# Altium schematic sheet 08_FPGA.SchDoc: FPGA
size A3; Organization: Lime Microsystems; Address1: Surrey Tech Centre; Address2: Guildford GU2 7YG; Address3: Surrey; Address4: United Kingdom; Revision: v2.1; SheetNumber: 8; SheetTotal: 15
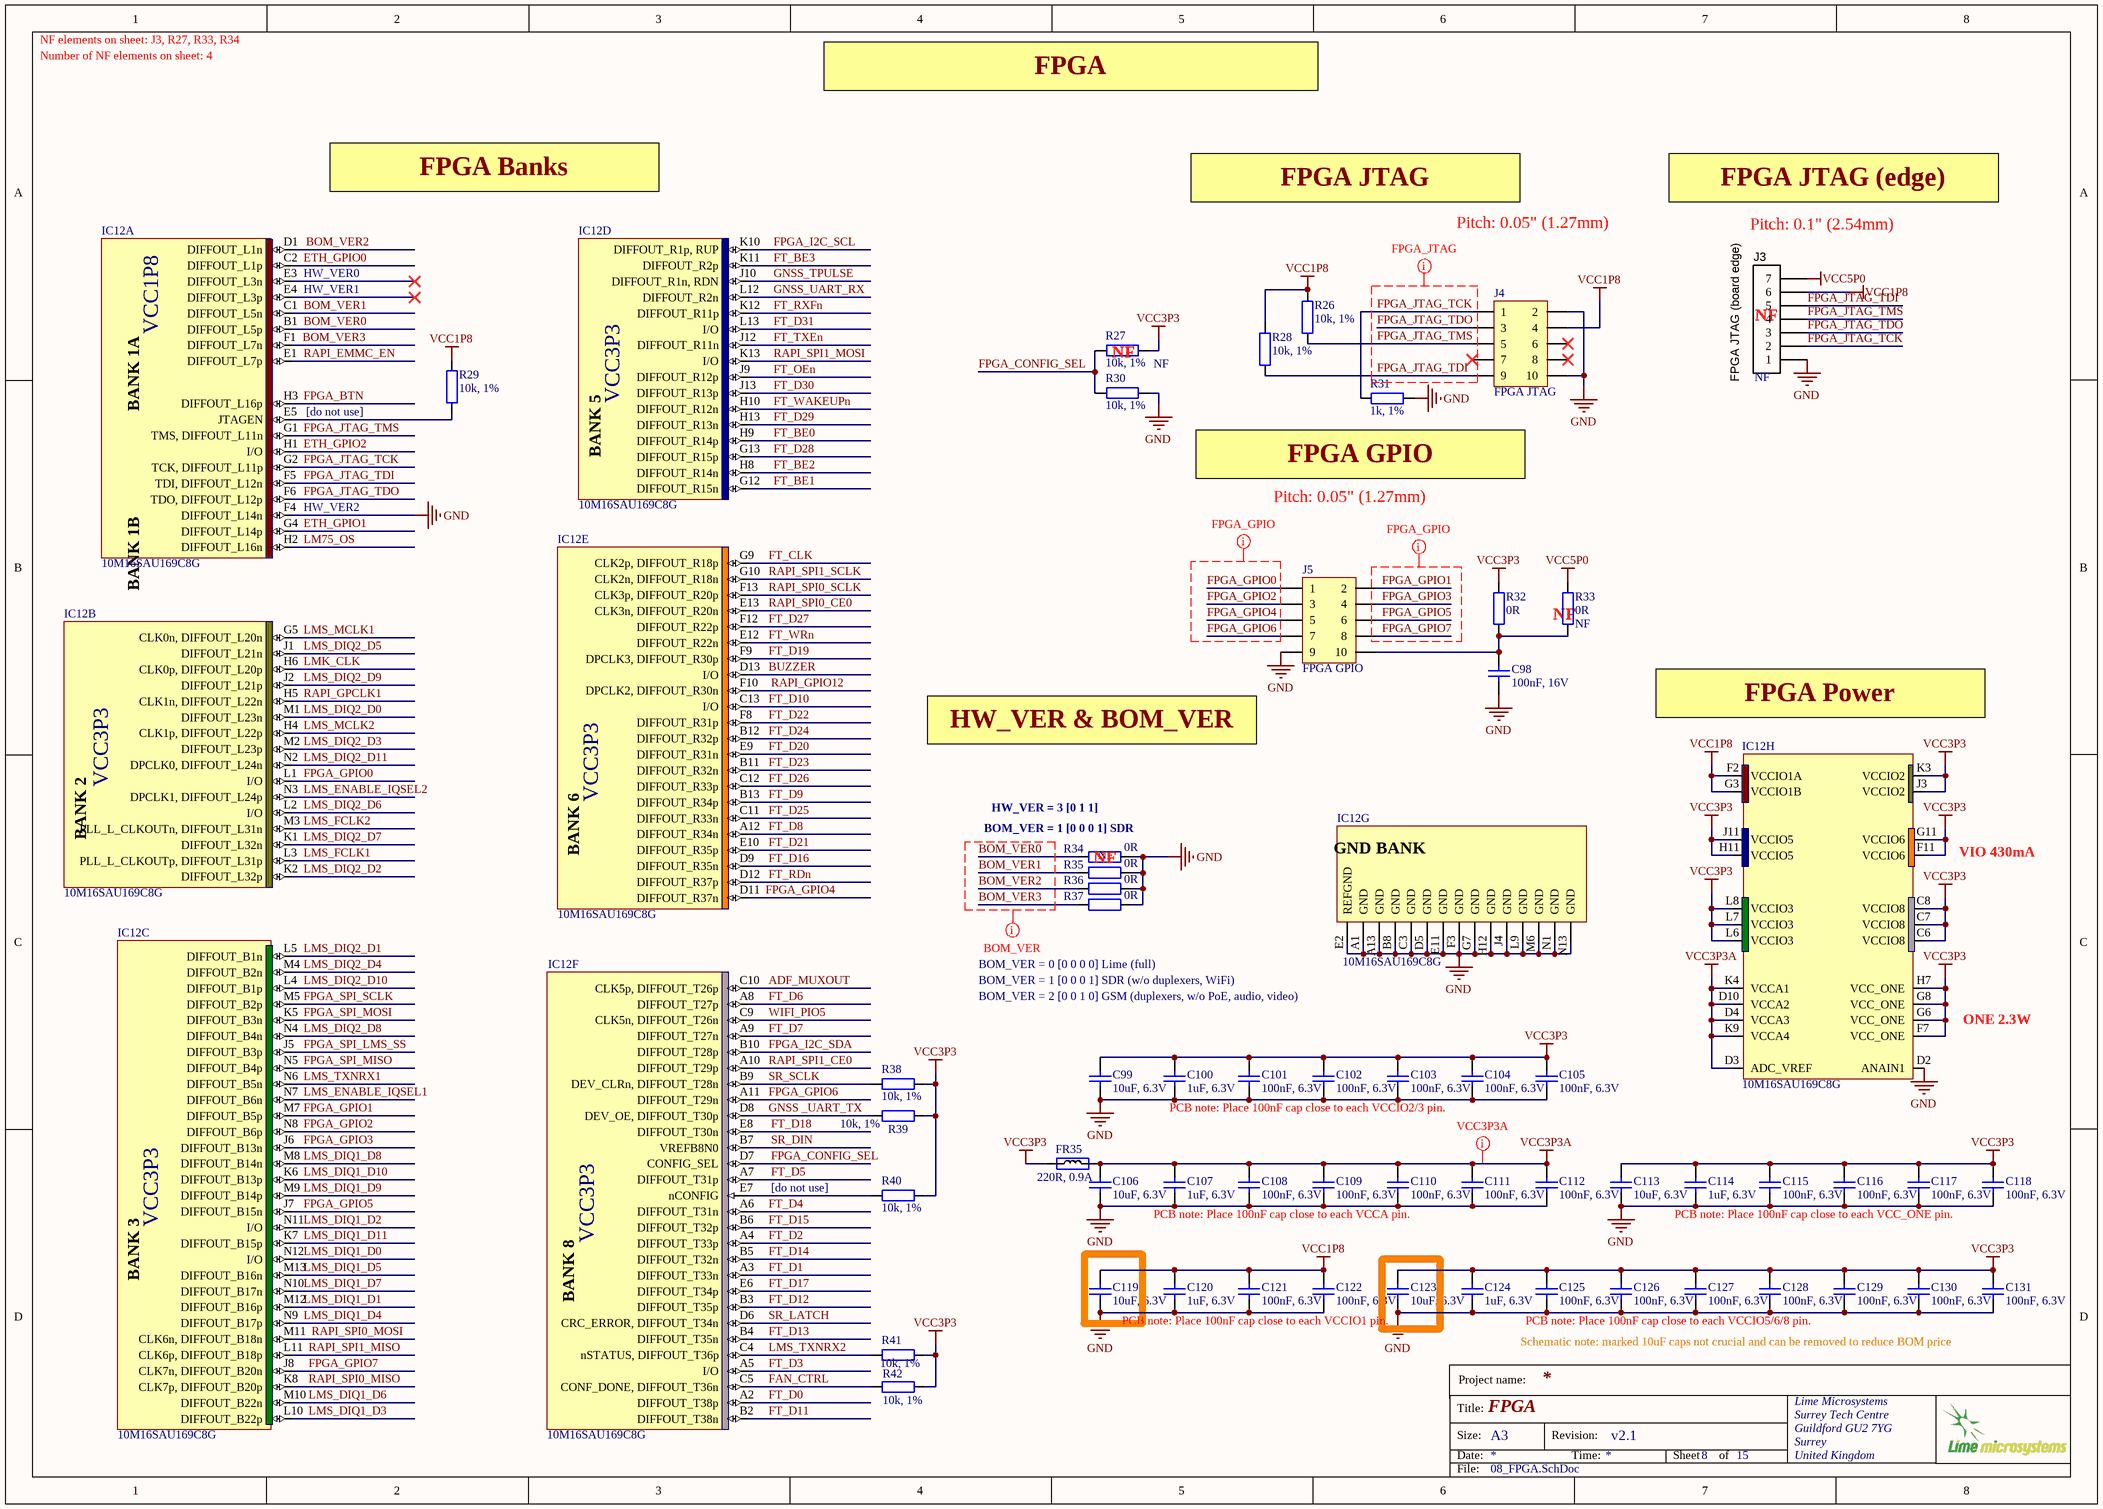
[diagram p0: 08_FPGA.SchDoc]

## Parts
C98  100nF, 16V  [CAP0402]
C99  10uF, 6.3V  [CAP0603]
C100  1uF, 6.3V  [CAP0201]
C101  100nF, 6.3V  [CAP0201]
C102  100nF, 6.3V  [CAP0201]
C103  100nF, 6.3V  [CAP0201]
C104  100nF, 6.3V  [CAP0201]
C105  100nF, 6.3V  [CAP0201]
C106  10uF, 6.3V  [CAP0603]
C107  1uF, 6.3V  [CAP0201]
C108  100nF, 6.3V  [CAP0201]
C109  100nF, 6.3V  [CAP0201]
C110  100nF, 6.3V  [CAP0201]
C111  100nF, 6.3V  [CAP0201]
C112  100nF, 6.3V  [CAP0201]
C113  10uF, 6.3V  [CAP0603]
C114  1uF, 6.3V  [CAP0201]
C115  100nF, 6.3V  [CAP0201]
C116  100nF, 6.3V  [CAP0201]
C117  100nF, 6.3V  [CAP0201]
C118  100nF, 6.3V  [CAP0201]
C119  10uF, 6.3V  [CAP0603]
C120  1uF, 6.3V  [CAP0201]
C121  100nF, 6.3V  [CAP0201]
C122  100nF, 6.3V  [CAP0201]
C123  10uF, 6.3V  [CAP0603]
C124  1uF, 6.3V  [CAP0201]
C125  100nF, 6.3V  [CAP0201]
C126  100nF, 6.3V  [CAP0201]
C127  100nF, 6.3V  [CAP0201]
C128  100nF, 6.3V  [CAP0201]
C129  100nF, 6.3V  [CAP0201]
C130  100nF, 6.3V  [CAP0201]
C131  100nF, 6.3V  [CAP0201]
FR35  220R, 0.9A  [RES0402]
IC12  10M16SAU169C8G  [10M16SAU169C8G]  (parts A,B,C,D,E,F,G,H of 8)
J3  FPGA JTAG (board edge)  Assembly Info: NF  [Header7x1_TH]
J4  FPGA JTAG  [SWD_10_pin]
J5  FPGA GPIO  [SWD_10_pin]
R26  10k, 1%  [RES0402]
R27  10k, 1%  Assembly Info: NF  [RES0402]
R28  10k, 1%  [RES0402]
R29  10k, 1%  [RES0402]
R30  10k, 1%  [RES0402]
R31  1k, 1%  [RES0402]
R32  0R  [RES0402]
R33  0R  Assembly Info: NF  [RES0402]
R34  0R  Assembly Info: NF  [RES0402]
R35  0R  [RES0402]
R36  0R  [RES0402]
R37  0R  [RES0402]
R38  10k, 1%  [RES0402]
R39  10k, 1%  [RES0402]
R40  10k, 1%  [RES0402]
R41  10k, 1%  [RES0402]
R42  10k, 1%  [RES0402]

## Nets
GND: C98.1 C99.1 C100.2 C101.2 C102.2 C103.2 C104.2 C105.2 C106.1 C107.2 C108.2 C109.2 C110.2 C111.2 C112.2 C113.1 C114.2 C115.2 C116.2 C117.2 C118.2 C119.1 C120.2 C121.2 C122.2 C123.1 C124.2 C125.2 C126.2 C127.2 C128.2 C129.2 C130.2 C131.2 IC12.A1(GND) IC12.A13(GND) IC12.B8(GND) IC12.C3(GND) IC12.D2(ANAIN1) IC12.D5(GND) IC12.E2(REFGND) IC12.E11(GND) IC12.F3(GND) IC12.F4(DIFFOUT_L14n) IC12.G7(GND) IC12.H12(GND) IC12.J4(GND) IC12.L9(GND) IC12.M6(GND) IC12.N1(GND) IC12.N13(GND) J3.1 J4.2 J4.10 J5.9 R30.1 R31.2 R34.1 R35.1 R36.1 R37.1
VCC1P8: C119.2 C120.1 C121.1 C122.1 IC12.F2(VCCIO1A) IC12.G3(VCCIO1B) J3.6 J4.4 R26.2 R28.2 R29.1
VCC3P3: C99.2 C100.1 C101.1 C102.1 C103.1 C104.1 C105.1 C113.2 C114.1 C115.1 C116.1 C117.1 C118.1 C123.2 C124.1 C125.1 C126.1 C127.1 C128.1 C129.1 C130.1 C131.1 FR35.1 IC12.C6(VCCIO8) IC12.C7(VCCIO8) IC12.C8(VCCIO8) IC12.F7(VCC_ONE) IC12.F11(VCCIO6) IC12.G6(VCC_ONE) IC12.G8(VCC_ONE) IC12.G11(VCCIO6) IC12.H7(VCC_ONE) IC12.H11(VCCIO5) IC12.J3(VCCIO2) IC12.J11(VCCIO5) IC12.K3(VCCIO2) IC12.L6(VCCIO3) IC12.L7(VCCIO3) IC12.L8(VCCIO3) R27.1 R32.1 R38.1 R39.1 R40.1 R41.1 R42.1
VCC3P3A: C106.2 C107.1 C108.1 C109.1 C110.1 C111.1 C112.1 FR35.2 IC12.D3(ADC_VREF) IC12.D4(VCCA3) IC12.D10(VCCA2) IC12.K4(VCCA1) IC12.K9(VCCA4)
VCC5P0: J3.7 R33.1
ADF_MUXOUT: IC12.C10(CLK5p,_DIFFOUT_T26p)
BOM_VER0: IC12.B1(DIFFOUT_L5p) R34.2
BOM_VER1: IC12.C1(DIFFOUT_L5n) R35.2
BOM_VER2: IC12.D1(DIFFOUT_L1n) R36.2
BOM_VER3: IC12.F1(DIFFOUT_L7n) R37.2
BUZZER: IC12.D13(I/O)
ETH_GPIO0: IC12.C2(DIFFOUT_L1p)
ETH_GPIO1: IC12.G4(DIFFOUT_L14p)
ETH_GPIO2: IC12.H1(I/O)
FAN_CTRL: IC12.C5(CONF_DONE,_DIFFOUT_T36n) R42.2
FPGA_BTN: IC12.H3(DIFFOUT_L16p)
FPGA_CONFIG_SEL: IC12.D7(CONFIG_SEL) R27.2 R30.2
FPGA_GPIO0: IC12.L1(I/O) J5.1
FPGA_GPIO1: IC12.M7(DIFFOUT_B5p) J5.2
FPGA_GPIO2: IC12.N8(DIFFOUT_B6p) J5.3
FPGA_GPIO3: IC12.J6(DIFFOUT_B13n) J5.4
FPGA_GPIO4: IC12.D11(DIFFOUT_R37n) J5.5
FPGA_GPIO5: IC12.J7(DIFFOUT_B15n) J5.6
FPGA_GPIO6: IC12.A11(DIFFOUT_T29n) J5.7
FPGA_GPIO7: IC12.J8(CLK7n,_DIFFOUT_B20n) J5.8
FPGA_I2C_SCL: IC12.K10(DIFFOUT_R1p,_RUP)
FPGA_I2C_SDA: IC12.B10(DIFFOUT_T28p)
FPGA_JTAG_TCK: IC12.G2(TCK,_DIFFOUT_L11p) J3.2 J4.1 R31.1
FPGA_JTAG_TDI: IC12.F5(TDI,_DIFFOUT_L12n) J3.5 J4.9 R28.1
FPGA_JTAG_TDO: IC12.F6(TDO,_DIFFOUT_L12p) J3.3 J4.3
FPGA_JTAG_TMS: IC12.G1(TMS,_DIFFOUT_L11n) J3.4 J4.5 R26.1
FPGA_SPI_LMS_SS: IC12.J5(DIFFOUT_B3p)
FPGA_SPI_MISO: IC12.N5(DIFFOUT_B4p)
FPGA_SPI_MOSI: IC12.K5(DIFFOUT_B3n)
FPGA_SPI_SCLK: IC12.M5(DIFFOUT_B2p)
FT_BE0: IC12.H9(DIFFOUT_R14p)
FT_BE1: IC12.G12(DIFFOUT_R15n)
FT_BE2: IC12.H8(DIFFOUT_R14n)
FT_BE3: IC12.K11(DIFFOUT_R2p)
FT_CLK: IC12.G9(CLK2p,_DIFFOUT_R18p)
FT_D0: IC12.A2(DIFFOUT_T38p)
FT_D1: IC12.A3(DIFFOUT_T33n)
FT_D2: IC12.A4(DIFFOUT_T33p)
FT_D3: IC12.A5(I/O)
FT_D4: IC12.A6(DIFFOUT_T31n)
FT_D5: IC12.A7(DIFFOUT_T31p)
FT_D6: IC12.A8(DIFFOUT_T27p)
FT_D7: IC12.A9(DIFFOUT_T27n)
FT_D8: IC12.A12(DIFFOUT_R34n)
FT_D9: IC12.B13(DIFFOUT_R34p)
FT_D10: IC12.C13(I/O)
FT_D11: IC12.B2(DIFFOUT_T38n)
FT_D12: IC12.B3(DIFFOUT_T35p)
FT_D13: IC12.B4(DIFFOUT_T35n)
FT_D14: IC12.B5(DIFFOUT_T32n)
FT_D15: IC12.B6(DIFFOUT_T32p)
FT_D16: IC12.D9(DIFFOUT_R35n)
FT_D17: IC12.E6(DIFFOUT_T34p)
FT_D18: IC12.E8(DIFFOUT_T30n)
FT_D19: IC12.F9(DPCLK3,_DIFFOUT_R30p)
FT_D20: IC12.E9(DIFFOUT_R31n)
FT_D21: IC12.E10(DIFFOUT_R35p)
FT_D22: IC12.F8(DIFFOUT_R31p)
FT_D23: IC12.B11(DIFFOUT_R32n)
FT_D24: IC12.B12(DIFFOUT_R32p)
FT_D25: IC12.C11(DIFFOUT_R33n)
FT_D26: IC12.C12(DIFFOUT_R33p)
FT_D27: IC12.F12(DIFFOUT_R22p)
FT_D28: IC12.G13(DIFFOUT_R15p)
FT_D29: IC12.H13(DIFFOUT_R13n)
FT_D30: IC12.J13(DIFFOUT_R13p)
FT_D31: IC12.L13(I/O)
FT_OEn: IC12.J9(DIFFOUT_R12p)
FT_RDn: IC12.D12(DIFFOUT_R37p)
FT_RXFn: IC12.K12(DIFFOUT_R11p)
FT_TXEn: IC12.J12(DIFFOUT_R11n)
FT_WAKEUPn: IC12.H10(DIFFOUT_R12n)
FT_WRn: IC12.E12(DIFFOUT_R22n)
GNSS _UART_TX: IC12.D8(DEV_OE,_DIFFOUT_T30p) R39.2
GNSS_TPULSE: IC12.J10(DIFFOUT_R1n,_RDN)
GNSS_UART_RX: IC12.L12(DIFFOUT_R2n)
LM75_OS: IC12.H2(DIFFOUT_L16n)
LMK_CLK: IC12.H6(CLK0p,_DIFFOUT_L20p)
LMS_DIQ1_D0: IC12.N12(I/O)
LMS_DIQ1_D1: IC12.M12(DIFFOUT_B16p)
LMS_DIQ1_D2: IC12.N11(I/O)
LMS_DIQ1_D3: IC12.L10(DIFFOUT_B22p)
LMS_DIQ1_D4: IC12.N9(DIFFOUT_B17p)
LMS_DIQ1_D5: IC12.M13(DIFFOUT_B16n)
LMS_DIQ1_D6: IC12.M10(DIFFOUT_B22n)
LMS_DIQ1_D7: IC12.N10(DIFFOUT_B17n)
LMS_DIQ1_D8: IC12.M8(DIFFOUT_B14n)
LMS_DIQ1_D9: IC12.M9(DIFFOUT_B14p)
LMS_DIQ1_D10: IC12.K6(DIFFOUT_B13p)
LMS_DIQ1_D11: IC12.K7(DIFFOUT_B15p)
LMS_DIQ2_D0: IC12.M1(DIFFOUT_L23n)
LMS_DIQ2_D1: IC12.L5(DIFFOUT_B1n)
LMS_DIQ2_D2: IC12.K2(DIFFOUT_L32p)
LMS_DIQ2_D3: IC12.M2(DIFFOUT_L23p)
LMS_DIQ2_D4: IC12.M4(DIFFOUT_B2n)
LMS_DIQ2_D5: IC12.J1(DIFFOUT_L21n)
LMS_DIQ2_D6: IC12.L2(I/O)
LMS_DIQ2_D7: IC12.K1(DIFFOUT_L32n)
LMS_DIQ2_D8: IC12.N4(DIFFOUT_B4n)
LMS_DIQ2_D9: IC12.J2(DIFFOUT_L21p)
LMS_DIQ2_D10: IC12.L4(DIFFOUT_B1p)
LMS_DIQ2_D11: IC12.N2(DPCLK0,_DIFFOUT_L24n)
LMS_ENABLE_IQSEL1: IC12.N7(DIFFOUT_B6n)
LMS_ENABLE_IQSEL2: IC12.N3(DPCLK1,_DIFFOUT_L24p)
LMS_FCLK1: IC12.L3(PLL_L_CLKOUTp,_DIFFOUT_L31p)
LMS_FCLK2: IC12.M3(PLL_L_CLKOUTn,_DIFFOUT_L31n)
LMS_MCLK1: IC12.G5(CLK0n,_DIFFOUT_L20n)
LMS_MCLK2: IC12.H4(CLK1p,_DIFFOUT_L22p)
LMS_TXNRX1: IC12.N6(DIFFOUT_B5n)
LMS_TXNRX2: IC12.C4(nSTATUS,_DIFFOUT_T36p) R41.2
RAPI_EMMC_EN: IC12.E1(DIFFOUT_L7p)
RAPI_GPCLK1: IC12.H5(CLK1n,_DIFFOUT_L22n)
RAPI_GPIO12: IC12.F10(DPCLK2,_DIFFOUT_R30n)
RAPI_SPI0_CE0: IC12.E13(CLK3n,_DIFFOUT_R20n)
RAPI_SPI0_MISO: IC12.K8(CLK7p,_DIFFOUT_B20p)
RAPI_SPI0_MOSI: IC12.M11(CLK6n,_DIFFOUT_B18n)
RAPI_SPI0_SCLK: IC12.F13(CLK3p,_DIFFOUT_R20p)
RAPI_SPI1_CE0: IC12.A10(DIFFOUT_T29p)
RAPI_SPI1_MISO: IC12.L11(CLK6p,_DIFFOUT_B18p)
RAPI_SPI1_MOSI: IC12.K13(I/O)
RAPI_SPI1_SCLK: IC12.G10(CLK2n,_DIFFOUT_R18n)
SR_DIN: IC12.B7(VREFB8N0)
SR_LATCH: IC12.D6(CRC_ERROR,_DIFFOUT_T34n)
SR_SCLK: IC12.B9(DEV_CLRn,_DIFFOUT_T28n) R38.2
WIFI_PIO5: IC12.C9(CLK5n,_DIFFOUT_T26n)
NetC98_2: C98.2 J5.10 R32.2 R33.2
NetIC12_E5: IC12.E5(JTAGEN) R29.2
NetIC12_E7: IC12.E7(nCONFIG) R40.2

Not connected (* = marked no-connect by the designer): IC12 E3(DIFFOUT_L3n)* E4(DIFFOUT_L3p)*; J4 6* 7* 8*

## Layout directives
net class FPGA_JTAG: FPGA_JTAG_TCK, FPGA_JTAG_TDI, FPGA_JTAG_TDO, FPGA_JTAG_TMS
net class VCC3P3A: VCC3P3A
net class FPGA_GPIO: FPGA_GPIO0, FPGA_GPIO1, FPGA_GPIO2, FPGA_GPIO3, FPGA_GPIO4, FPGA_GPIO5, FPGA_GPIO6, FPGA_GPIO7
net class BOM_VER: BOM_VER0, BOM_VER1, BOM_VER2, BOM_VER3

## Notes on the sheet
- NF elements on sheet: J3, R27, R33, R34
- Number of NF elements on sheet: 4
- FPGA
- FPGA Banks
- FPGA JTAG
- Pitch: 0.05" (1.27mm)
- FPGA JTAG (edge)
- (near J3) Pitch: 0.1" (2.54mm)
- (near IC12) HW_VER0
- (near IC12) HW_VER1
- (near J3) NF
- VCC1P8
- (near R27) NF
- (near IC12) [do not use]
- VCC3P3
- (near IC12) HW_VER2
- (near R31) FPGA GPIO
- (near R33) NF
- FPGA Power
- HW_VER & BOM_VER
- (near R34) BOM_VER = 1 [0 0 0 1] SDR
- HW_VER = 3 [0 1 1]
- (near IC12) VIO 430mA
- (near R34) NF
- BOM_VER = 0 [0 0 0 0] Lime (full)
- BOM_VER = 1 [0 0 0 1] SDR (w/o duplexers, WiFi)
- BOM_VER = 2 [0 0 1 0] GSM (duplexers, w/o PoE, audio, video)
- (near IC12) ONE 2.3W
- PCB note: Place 100nF cap close to each VCCIO2/3 pin.
- [do not use]
- PCB note: Place 100nF cap close to each VCCA pin.
- PCB note: Place 100nF cap close to each VCC_ONE pin.
- PCB note: Place 100nF cap close to each VCCIO1 pin.
- PCB note: Place 100nF cap close to each VCCIO5/6/8 pin.
- Schematic note: marked 10uF caps not crucial and can be removed to reduce BOM price
- Project name:
- Title:
- Size:
- Date:
- A3
- Revision:
- Time:
- Sheet
- of
- File:
- (in symbol 10M16SAU169C8G, part A) BANK 1A; BANK 1B
- (in symbol 10M16SAU169C8G, part B) BANK 2
- (in symbol 10M16SAU169C8G, part C) BANK 3
- (in symbol 10M16SAU169C8G, part D) BANK 5
- (in symbol 10M16SAU169C8G, part E) BANK 6
- (in symbol 10M16SAU169C8G, part F) BANK 8
- (in symbol 10M16SAU169C8G, part G) GND BANK

## Library data of the parts
C98 = Cap_0402: Manufacturer: Murata Electronics; Manufacturer Part Number: GRM155R71C104KA88D; Part Description: CAP CER 0.1UF 16V X7R 0402; Tolerance: 10 %; Type: General Purpose MLCC; Capacitance: 0.1 uF; Case Length: 1 mm; Dielectric: X7R; Case Height: 0.5 mm; Temperature Coefficient / Code: +/- 15 %; Value: 100nF, 16V; Supplier 1: Mouser; Supplier Part Number 1: 81-GRM155R71C104KA88; Case Code - in: 0402; RoHS: RoHS Compliant; Operating Temperature Range: - 55 C to + 125 C; Series: GRM; Termination Style: SMD/SMT; Package / Case: 0402 (1005 metric); Voltage Rating DC: 16 V; Maximum Operating Temperature: + 125 C; Case Code - mm: 1005; Minimum Operating Temperature: - 55 C; Product Category: Low & Medium Capacitance SMD Ceramic Chip Capacitors; Packaging: Reel; Product: General Type MLCCs; Category: Multilayer Ceramic Capacitors MLCC - SMD/SMT; Brand: Murata Electronics; Case Width: 0.5 mm; RoHS - Mouser: Y; Standard Pack Qty: 10000; Minimum Order Quantity: 1; Reeling: True; Manufacturer Part Number 1: GRM155R71C104KA88D
C99 C106 C113 C119 C123 = Cap_0603: Manufacturer Part Number 1: CC0603MRX5R5BB106; Manufacturer: Yageo; Part Description: 10µF ±20% 6.3V X5R Ceramic Capacitor -55°C ~ 85°C Surface Mount, MLCC 0603 (1608 Metric) 0.063" L x 0.031" W (1.60mm x 0.80mm); Capacitance: 10µF; Tolerance: ±20%; Supplier 1: Digi-Key; Supplier Part Number 1: 311-1448-2-ND; Package / Case: 0603 (1608 Metric); Category: Capacitors; Voltage - Rated: 6.3V; Value: 10uF, 6.3V
C100 C107 C114 C120 C124 = Cap_0402: Manufacturer: TDK Corporation; Manufacturer Part Number 1: JMK063ABJ105MP-F; Part Description: 1µF ±20% 6.3V X5R Ceramic Capacitor -55°C ~ 85°C Surface Mount, MLCC 0201 (0603 Metric) 0.024" L x 0.012" W (0.60mm x 0.30mm); Value: 1uF, 20%; Tolerance: ±20%; Capacitance: 1.0µF; Temperature Coefficient: X5R; Supplier 1: Digi-Key; Supplier Part Number 1: 587-5864-2-ND; Applications: General Purpose; Features: -; Lead Style: -; Ratings: -; Thickness (Max): -; Lead Spacing: -; Height - Seated (Max): -; Size / Dimension: 0.024" L x 0.012" W (0.60mm x 0.30mm); Mounting Type: Surface Mount, MLCC; Operating Temperature: -55°C ~ 85°C; Package / Case: 0201 (0603 Metric); Packaging: Cut Tape (CT); Voltage - Rated: 6.3V; Category: Capacitors; RoHS: RoHS Compliant
C101-C105 C108-C112 C115-C118 C121 C122 C125-C131 = Cap_0402: Manufacturer: Murata; Manufacturer Part Number 1: GRT033C81A104KE01D; Part Description: 0.10µF ±10% 6.3V X6S Ceramic Capacitor -55°C ~ 105°C Surface Mount, MLCC 0201 (0603 Metric) 0.024" L x 0.012" W (0.60mm x 0.30mm); Capacitance: 0.1 uF; Dielectric: X6S; Brand: Murata Electronics; Type: Voltage and Temperature Derating Recommended Product; Voltage Rating DC: 6.3 VDC; Product Status: New Product; Tolerance: 10 %; Value: 100nF, 6.3V; Package / Case: 0201 (0603 metric); Width: 0.3 mm; Minimum Order Quantity: 1; Category: Multilayer Ceramic Capacitors MLCC - SMD/SMT; Termination Style: SMD/SMT; Case Code - mm: 0603; Maximum Operating Temperature: + 125 C; Length: 0.6 mm; Product: General Type MLCCs; Case Code - in: 0201; RoHS: RoHS Compliant; Minimum Operating Temperature: - 55 C; RoHS - Mouser: Y; Height: 0.3 mm; Packaging: Reel; Series: GRM; Reeling: True; Supplier 1: Digi-Key; Supplier Part Number 1: 490-12232-1-ND
FR35 = Ferrite: Manufacturer: TDK Corporation; Manufacturer Part Number 1: MPZ1005S221ET000; Part Description: FERRITE BEAD 220 OHM 0402 1LN; Impedance @ Frequency: 220 Ohm @ 100MHz; Current Rating: 900mA; DC Resistance (DCR): 220 mOhm Max; Supplier 1: Digi-Key; Package / Case: 0402 (1005 Metric); Category: Filters; Supplier Part Number 1: 445-9329-2-ND; Value: 220R, 0.9A
IC12 = 10M16SAU169C8G: Manufacturer: Altera; Part Description: IC FPGA/CPLD NV 130 I/O 169UBGA; Number of LABs/CLBs: 1000; Number of Logic Elements/Cells: 16000; Total RAM Bits: 562176; Number of I/O: 130; Voltage - Supply: 2.85 V ~ 3.465 V; Supplier 1: Digi-Key; RoHS: RoHS Compliant; Number of Gates: -; Mounting Type: Surface Mount; Operating Temperature: 0°C ~ 85°C (TJ); Package / Case: 169-LFBGA; Supplier Device Package: 169-UBGA (11x11); Category: Integrated Circuits (ICs); Manufacturer Part Number 1: 10M16SAU169C8G; Supplier Part Number 1: 544-3110-ND
J3 = Header7P: Header, 7-pin; Manufacturer: Sullins Connector Solutions; Manufacturer Part Number 1: PEC07SAAN; Part Description: 7 Positions Header, Unshrouded, Breakaway Connector 0.100" (2.54mm) Through Hole Tin; Number of Positions Loaded: All; Pitch: 0.100" (2.54mm); Number of Positions: 7; Connector Type: Header, Unshrouded, Breakaway; Supplier 1: Digi-Key; Color: Black; Packaging: Bulk; Category: Connectors, Interconnects; Contact Finish: Tin; Number of Rows: 1; RoHS: RoHS Compliant; Contact Type: Male Pin; Mounting Type: Through Hole; Features: -; Contact Mating Length: 0.230" (5.84mm); Termination: Solder; Fastening Type: -; Contact Finish Thickness: 100µin (2.54µm); Row Spacing: -; Supplier Part Number 1: S1012E-07-ND
J4 J5 = Header 5X2_SWD: Header, 5-Pin, Dual row; Manufacturer Part Number 1: M50-3600542; Manufacturer: Harwin Inc; Part Description: CONN HDR 1.27MM SMD AU 10POS; Number of Positions: 10; Molding Height Above Board: 0.039" (1.00mm); Row Spacing: 0.050" (1.27mm); Number of Positions Loaded: All; Connector Type: Unshrouded; Supplier 1: Digi-Key; Contact Mating Length: 0.118" (3.00mm); Category: Connectors, Interconnects; Color: Black; RoHS: RoHS Compliant; Number of Rows: 2; Contact Finish Thickness: 3µin (0.08µm); Height Stacking (Mating): -; Contact Finish: Gold; Termination: Solder; Mounting Type: Surface Mount; Pitch: 0.050" (1.27mm); Features: -; Packaging: Bulk; Supplier Part Number 1: 952-1389-ND
R26-R30 R38-R42 = Res_0402: Manufacturer: Yageo; Manufacturer Part Number 1: RC0402FR-0710KL; Part Description: RES SMD 10K OHM 1% 1/16W 0402; Temperature Coefficient: ±100ppm/°C; Power (Watts): 0.063W, 1/16W; Value: 10k, 1%; Supplier 1: Digi-Key; Supplier Part Number 1: 311-10.0KLRTR-ND; Resistance (Ohms): 10k; Packaging: Tape & Reel (TR); RoHS: RoHS Compliant; Package / Case: 0402 (1005 Metric); Tolerance: ±1%; Operating Temperature: -55°C ~ 155°C; Size / Dimension: 0.039" L x 0.020" W (1.00mm x 0.50mm); Number of Terminations: 2; Category: Resistors; Height: 0.016" (0.40mm); Supplier Device Package: 0402; Features: Moisture Resistant; Composition: Thick Film
R31 = Res_0402: Manufacturer: Stackpole Electronics Inc; Manufacturer Part Number 1: RMCF0402FT1K00; Part Description: RES SMD 1K OHM 1% 1/16W 0402; Temperature Coefficient: ±100ppm/°C; Power (Watts): 0.063W, 1/16W; Value: 1k, 1%; Supplier 1: Digi-Key; Supplier Part Number 1: RMCF0402FT1K00TR-ND; Package / Case: 0402 (1005 Metric); Supplier Device Package: 0402; Height: 0.016" (0.40mm); Size / Dimension: 0.039" L x 0.020" W (1.00mm x 0.50mm); Number of Terminations: 2; Packaging: Cut Tape (CT); Category: Resistors; Composition: Thick Film; Resistance (Ohms): 1k; Tolerance: ±1%; Features: Moisture Resistant; Operating Temperature: -55°C ~ 155°C; RoHS: RoHS Compliant
R32-R37 = Res_0402: Manufacturer: Yageo; Part Description: RES SMD 0.0OHM JUMPER 1/16W 0402; Manufacturer Part Number 1: RC0402JR-070RL; Power (Watts): 0.063W, 1/16W; Resistance (Ohms): 0.0; Tolerance: Jumper; Supplier 1: Digi-Key; Supplier Part Number 1: 311-0.0JRTR-ND; Composition: Thick Film; Package / Case: 0402 (1005 Metric); Category: Resistors; Value: 0R; Features: Moisture Resistant; Height: 0.016" (0.40mm); Number of Terminations: 2; Operating Temperature: -55°C ~ 155°C; Packaging: Tape & Reel (TR); RoHS: RoHS Compliant; Size / Dimension: 0.039" L x 0.020" W (1.00mm x 0.50mm); Supplier Device Package: 0402; Temperature Coefficient: -